# EAGLE design CAN Bus Controller with LED Lamp Drivers - REV 1 (EAGLE 9.6.2)
DOC_NAME: CAN BUS CONTROLLER; DOC_REVISION: 1; INITIALS_DRAWN: KJD
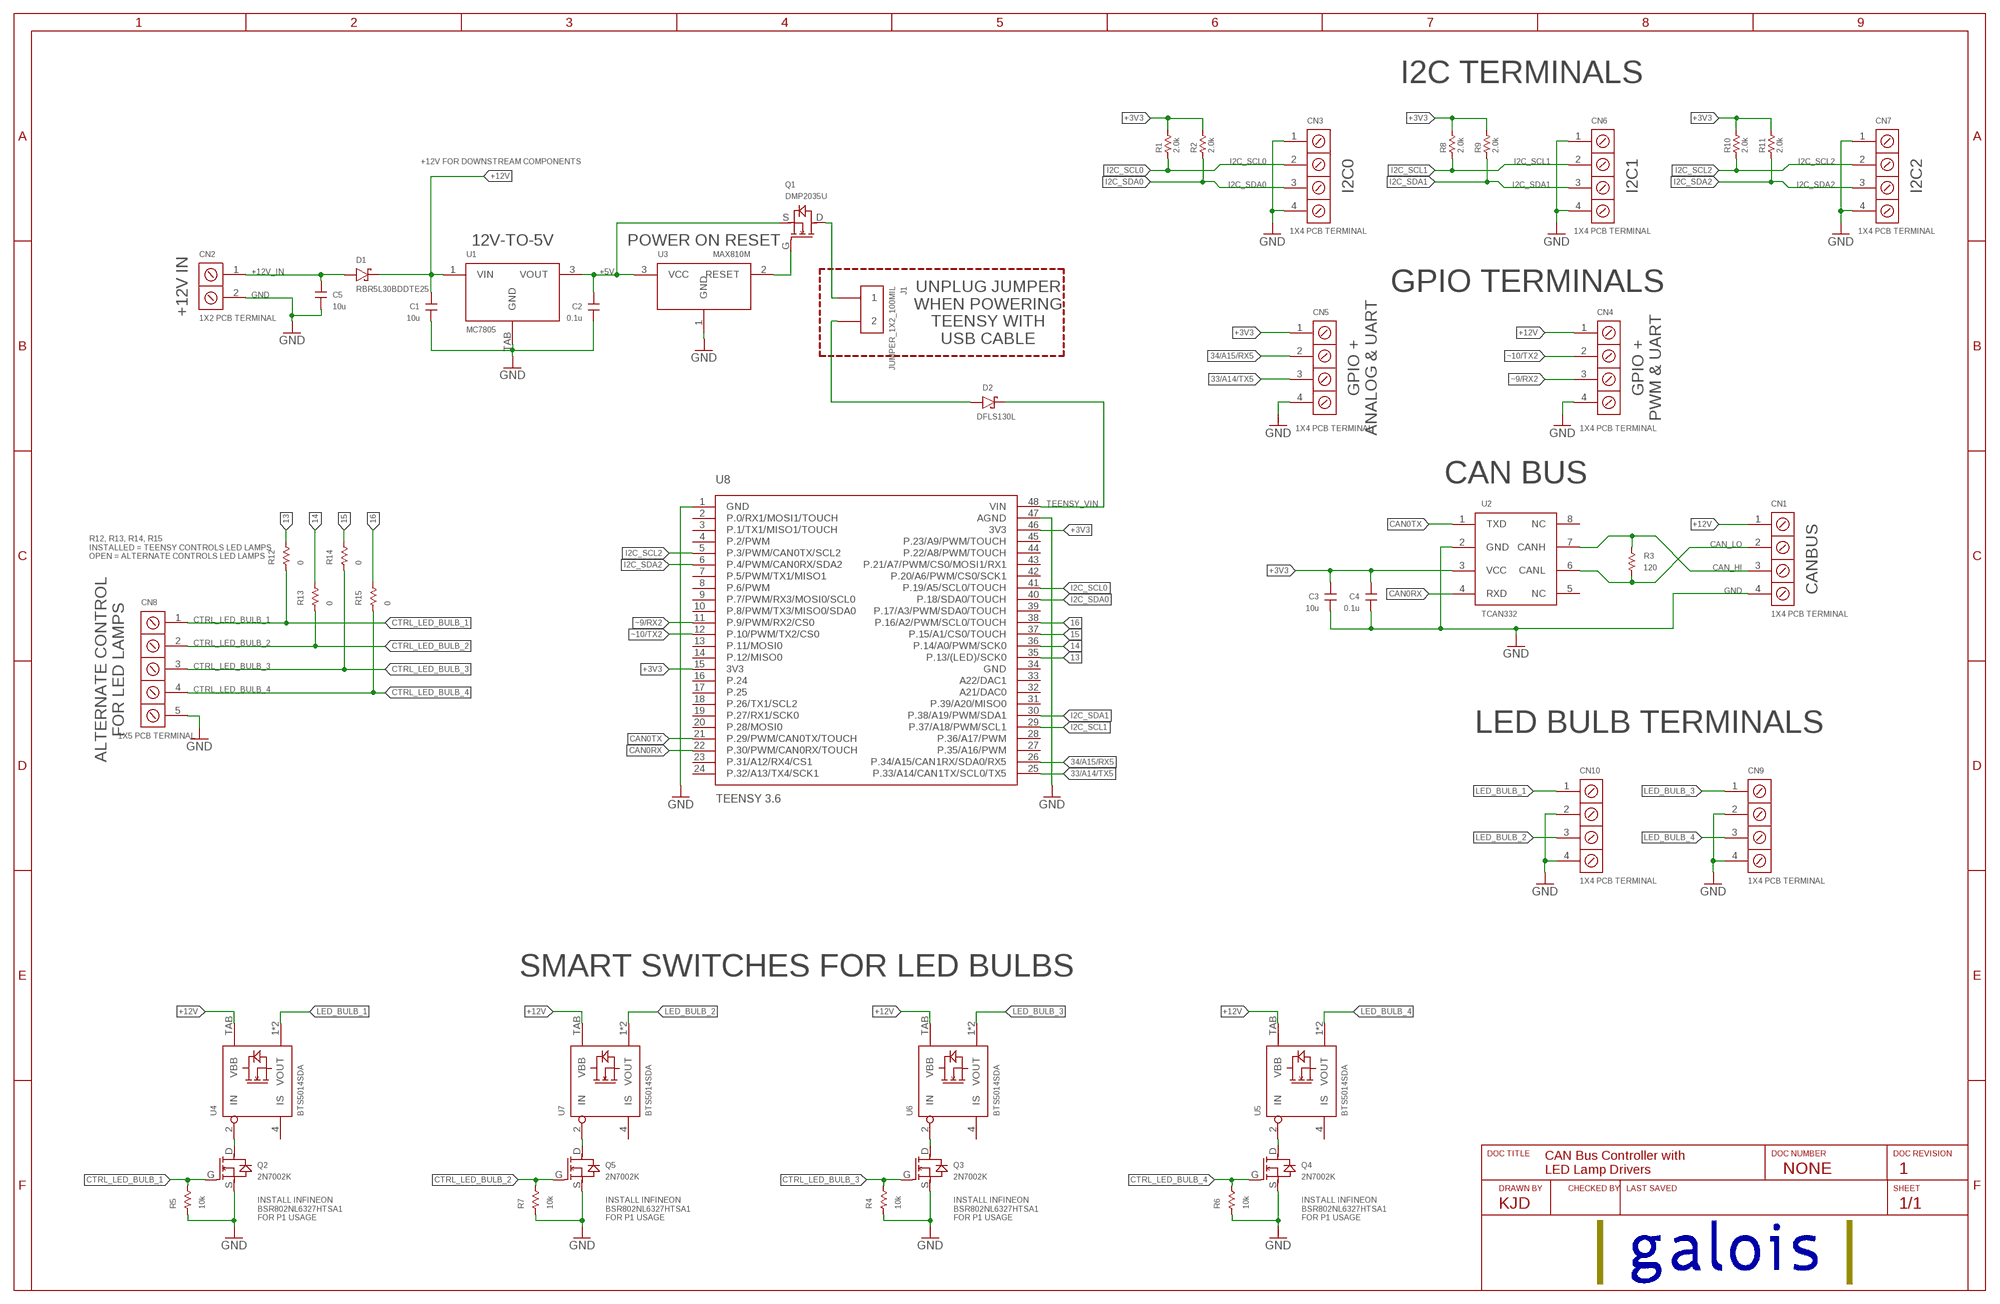
[diagram p0: schematic, sheet 1]

## Parts
C1  10u  C_SMDC1206  [EIA1206]
C2  0.1u  C_SMDC0603  [EIA0603]
C3  10u  C_SMDC1206  [EIA1206]
C4  0.1u  C_SMDC0603  [EIA0603]
C5  10u  C_SMDC1206  [EIA1206]
CN1  1X4 PCB TERMINAL  1984633  [PCB_TERM_3.5MM_PITCH_1X4]
CN2  1X2 PCB TERMINAL  1984617  [PCB_TERM_3.5MM_PITCH_1X2]
CN3  1X4 PCB TERMINAL  1984633  [PCB_TERM_3.5MM_PITCH_1X4]
CN4  1X4 PCB TERMINAL  1984633  [PCB_TERM_3.5MM_PITCH_1X4]
CN5  1X4 PCB TERMINAL  1984633  [PCB_TERM_3.5MM_PITCH_1X4]
CN6  1X4 PCB TERMINAL  1984633  [PCB_TERM_3.5MM_PITCH_1X4]
CN7  1X4 PCB TERMINAL  1984633  [PCB_TERM_3.5MM_PITCH_1X4]
CN8  1X5 PCB TERMINAL  1984646  [PCB_TERM_3.5MM_PITCH_1X5]
CN9  1X4 PCB TERMINAL  1984633  [PCB_TERM_3.5MM_PITCH_1X4]
CN10  1X4 PCB TERMINAL  1984633  [PCB_TERM_3.5MM_PITCH_1X4]
D1  RBR5L30BDDTE25  SCHOTTKYSMA  [SMA]
D2  DFLS130L  SCHOTTKYPOWERDI_123  [POWERDI_123]
J1  JUMPER_1X2_100MIL  1X2  [1X2_100MIL_THRU]
Q1  DMP2035U  [SOT-23-3]
Q2  2N7002K  [SOT-23-3]
Q3  2N7002K  [SOT-23-3]
Q4  2N7002K  [SOT-23-3]
Q5  2N7002K  [SOT-23-3]
R1  2.0k  R_SMDR0603  [EIA0603]
R2  2.0k  R_SMDR0603  [EIA0603]
R3  120  R_SMDR1210  [EIA1210]
R4  10k  R_SMDR0603  [EIA0603]
R5  10k  R_SMDR0603  [EIA0603]
R6  10k  R_SMDR0603  [EIA0603]
R7  10k  R_SMDR0603  [EIA0603]
R8  2.0k  R_SMDR0603  [EIA0603]
R9  2.0k  R_SMDR0603  [EIA0603]
R10  2.0k  R_SMDR0603  [EIA0603]
R11  2.0k  R_SMDR0603  [EIA0603]
R12  0  R_SMDR0603  [EIA0603]
R13  0  R_SMDR0603  [EIA0603]
R14  0  R_SMDR0603  [EIA0603]
R15  0  R_SMDR0603  [EIA0603]
U1  MC7805  MC78XX  [DPAK-3]
U2  TCAN332  TCAN332_CANBUS_RXTX  [SOIC-8]
U3  MAX810M  MAX809/810  [SOT23-3]
U4  BTS5014SDA  [PG-TO252-5-11]
U5  BTS5014SDA  [PG-TO252-5-11]
U6  BTS5014SDA  [PG-TO252-5-11]
U7  BTS5014SDA  [PG-TO252-5-11]
U8  TEENSY 3.6  TEENSY3.6NO_UNDER_PINS  [TEENSY3.6]

## Nets
13: R12.P$2 U8.35(P.13/(LED)/SCK0)
14: R13.P$2 U8.36(P.14/A0/PWM/SCK0)
15: R14.P$2 U8.37(P.15/A1/CS0/TOUCH)
16: R15.P$2 U8.38(P.16/A2/PWM/SCL0/TOUCH)
33/A14/TX5: CN5.3 U8.25(P.33/A14/CAN1TX/SCL0/TX5)
34/A15/RX5: CN5.2 U8.26(P.34/A15/CAN1RX/SDA0/RX5)
+3V3: C3.P$2 C4.P$2 CN5.1 R1.P$2 R2.P$2 R8.P$2 R9.P$2 R10.P$2 R11.P$2 U2.3(VCC) U8.15(3V3) U8.46(3V3)
+5V: C2.P$2 Q1.S U1.3(VOUT) U3.3(VCC)
+12V: C1.P$2 CN1.1 CN4.1 D1.C U1.1(VIN) U4.TAB(VBB) U5.TAB(VBB) U6.TAB(VBB) U7.TAB(VBB)
+12V_IN: C5.P$2 CN2.1 D1.A
CAN0RX: U2.4(RXD) U8.22(P.30/PWM/CAN0RX/TOUCH)
CAN0TX: U2.1(TXD) U8.21(P.29/PWM/CAN0TX/TOUCH)
CAN_HI: CN1.3 R3.P$2 U2.7(CANH)
CAN_LO: CN1.2 R3.P$1 U2.6(CANL)
CTRL_LED_BULB_1: CN8.1 Q2.G R5.P$2 R12.P$1
CTRL_LED_BULB_2: CN8.2 Q5.G R7.P$2 R13.P$1
CTRL_LED_BULB_3: CN8.3 Q3.G R4.P$2 R14.P$1
CTRL_LED_BULB_4: CN8.4 Q4.G R6.P$2 R15.P$1
GND: C1.P$1 C2.P$1 C3.P$1 C4.P$1 C5.P$1 CN1.4 CN2.2 CN3.1 CN3.4 CN4.4 CN5.4 CN6.1 CN6.4 CN7.1 CN7.4 CN8.5 CN9.2 CN9.4 CN10.2 CN10.4 Q2.S Q3.S Q4.S Q5.S R4.P$1 R5.P$1 R6.P$1 R7.P$1 U1.TAB(GND) U2.2(GND) U3.1(GND) U8.1(GND) U8.47(AGND)
I2C_SCL0: CN3.2 R1.P$1 U8.41(P.19/A5/SCL0/TOUCH)
I2C_SCL1: CN6.2 R8.P$1 U8.29(P.37/A18/PWM/SCL1)
I2C_SCL2: CN7.2 R10.P$1 U8.5(P.3/PWM/CAN0TX/SCL2)
I2C_SDA0: CN3.3 R2.P$1 U8.40(P.18/SDA0/TOUCH)
I2C_SDA1: CN6.3 R9.P$1 U8.30(P.38/A19/PWM/SDA1)
I2C_SDA2: CN7.3 R11.P$1 U8.6(P.4/PWM/CAN0RX/SDA2)
LED_BULB_1: CN10.1 U4.1(VOUT) U4.5(VOUT)
LED_BULB_2: CN10.3 U7.1(VOUT) U7.5(VOUT)
LED_BULB_3: CN9.1 U6.1(VOUT) U6.5(VOUT)
LED_BULB_4: CN9.3 U5.1(VOUT) U5.5(VOUT)
N$1: J1.1 Q1.D
N$2: D2.A J1.2
N$3: Q2.D U4.2(IN)
N$4: Q4.D U5.2(IN)
N$5: Q5.D U7.2(IN)
N$20: Q3.D U6.2(IN)
N$26: Q1.G U3.2(RESET)
TEENSY_VIN: D2.C U8.48(VIN)
~9/RX2: CN4.3 U8.11(P.9/PWM/RX2/CS0)
~10/TX2: CN4.2 U8.12(P.10/PWM/TX2/CS0)
Unconnected: U2.5(NC) U2.8(NC) U4.4(IS) U5.4(IS) U6.4(IS) U7.4(IS) U8.2(P.0/RX1/MOSI1/TOUCH) U8.3(P.1/TX1/MISO1/TOUCH) U8.4(P.2/PWM) U8.7(P.5/PWM/TX1/MISO1) U8.8(P.6/PWM) U8.9(P.7/PWM/RX3/MOSI0/SCL0) U8.10(P.8/PWM/TX3/MISO0/SDA0) U8.13(P.11/MOSI0) U8.14(P.12/MISO0) U8.16(P.24) U8.17(P.25) U8.18(P.26/TX1/SCL2) U8.19(P.27/RX1/SCK0) U8.20(P.28/MOSI0) U8.23(P.31/A12/RX4/CS1) U8.24(P.32/A13/TX4/SCK1) U8.27(P.35/A16/PWM) U8.28(P.36/A17/PWM) U8.31(P.39/A20/MISO0) U8.32(A21/DAC0) U8.33(A22/DAC1) U8.34(GND) U8.39(P.17/A3/PWM/SDA0/TOUCH) U8.42(P.20/A6/PWM/CS0/SCK1) U8.43(P.21/A7/PWM/CS0/MOSI1/RX1) U8.44(P.22/A8/PWM/TOUCH) U8.45(P.23/A9/PWM/TOUCH)

## Notes on the sheet
- I2C TERMINALS
- +12V FOR DOWNSTREAM COMPONENTS
- I2C0 | I2C1 | I2C2
- 12V-TO-5V | POWER ON RESET
- +12V IN
- GPIO TERMINALS
- UNPLUG JUMPER
  WHEN POWERING
  TEENSY WITH
  USB CABLE
- GPIO +
  ANALOG & UART
- GPIO +
  PWM & UART
- CAN BUS
- R12, R13, R14, R15
  INSTALLED = TEENSY CONTROLS LED LAMPS
  OPEN = ALTERNATE CONTROLS LED LAMPS
- CANBUS
- ALTERNATE CONTROL
  FOR LED LAMPS
- LED BULB TERMINALS
- SMART SWITCHES FOR LED BULBS
- CAN Bus Controller with
  LED Lamp Drivers
- NONE | 1
- KJD
- INSTALL INFINEON
  BSR802NL6327HTSA1
  FOR P1 USAGE
- INSTALL INFINEON
  BSR802NL6327HTSA1
  FOR P1 USAGE
- INSTALL INFINEON
  BSR802NL6327HTSA1
  FOR P1 USAGE
- INSTALL INFINEON
  BSR802NL6327HTSA1
  FOR P1 USAGE

## Library data of the parts
C1 C3 C5 = USER_SMT_CHIP_STANDARD:C_SMD; MPN: CL31A106KBHNNNE; PACKAGE: 1206
C2 C4 = USER_SMT_CHIP_STANDARD:C_SMD; MPN: CL10B104KA8NNNC; PACKAGE: 0603
CN1 CN3-CN7 CN9 CN10 = USER_PCB_TERMINALS:1984633; MPN: 1984633
CN2 = USER_PCB_TERMINALS:1984617; MPN: 1984617
CN8 = USER_PCB_TERMINALS:1984646; MPN: 1984646
D1 = USER_DIODES:SCHOTTKY; MPN: RBR5L30BDDTE25
D2 = USER_DIODES:SCHOTTKY; MPN: DFLS130L-7
J1 = USER_CON_PINS:1X2; MPN: QPC02SXGN-RC
Q1 = USER_MOSFETS:DMP2035U; MPN: DMP2035U-7
Q2-Q5 = USER_MOSFETS:2N7002K; MPN: 2N7002K-7
R1 R2 R8-R11 = USER_SMT_CHIP_STANDARD:R_SMD; MPN: ERJ-3EKF2001V
R3 = USER_SMT_CHIP_STANDARD:R_SMD; MPN: AC1210FR-07120RL
R4-R7 = USER_SMT_CHIP_STANDARD:R_SMD; MPN: ERJ-3EKF1002V
R12-R15 = USER_SMT_CHIP_STANDARD:R_SMD; MPN: ERJ-3GEY0R00V
U1 = USER_PMIC:MC78XX; MPN: MC7805CDTRKG
U2 = USER_SERIAL_TRANSCEIVERS:TCAN332_CANBUS_RXTX; MPN: TCAN332DR
U3 = USER_PMIC:MAX809/810; MPN: MAX810MTRG
U4-U7 = USER_SMART_SWITCHES:BTS5014SDA; MPN: BTS5014SDAAUMA1
U8 = USER_PJRC_TEENSY:TEENSY3.6

## Board
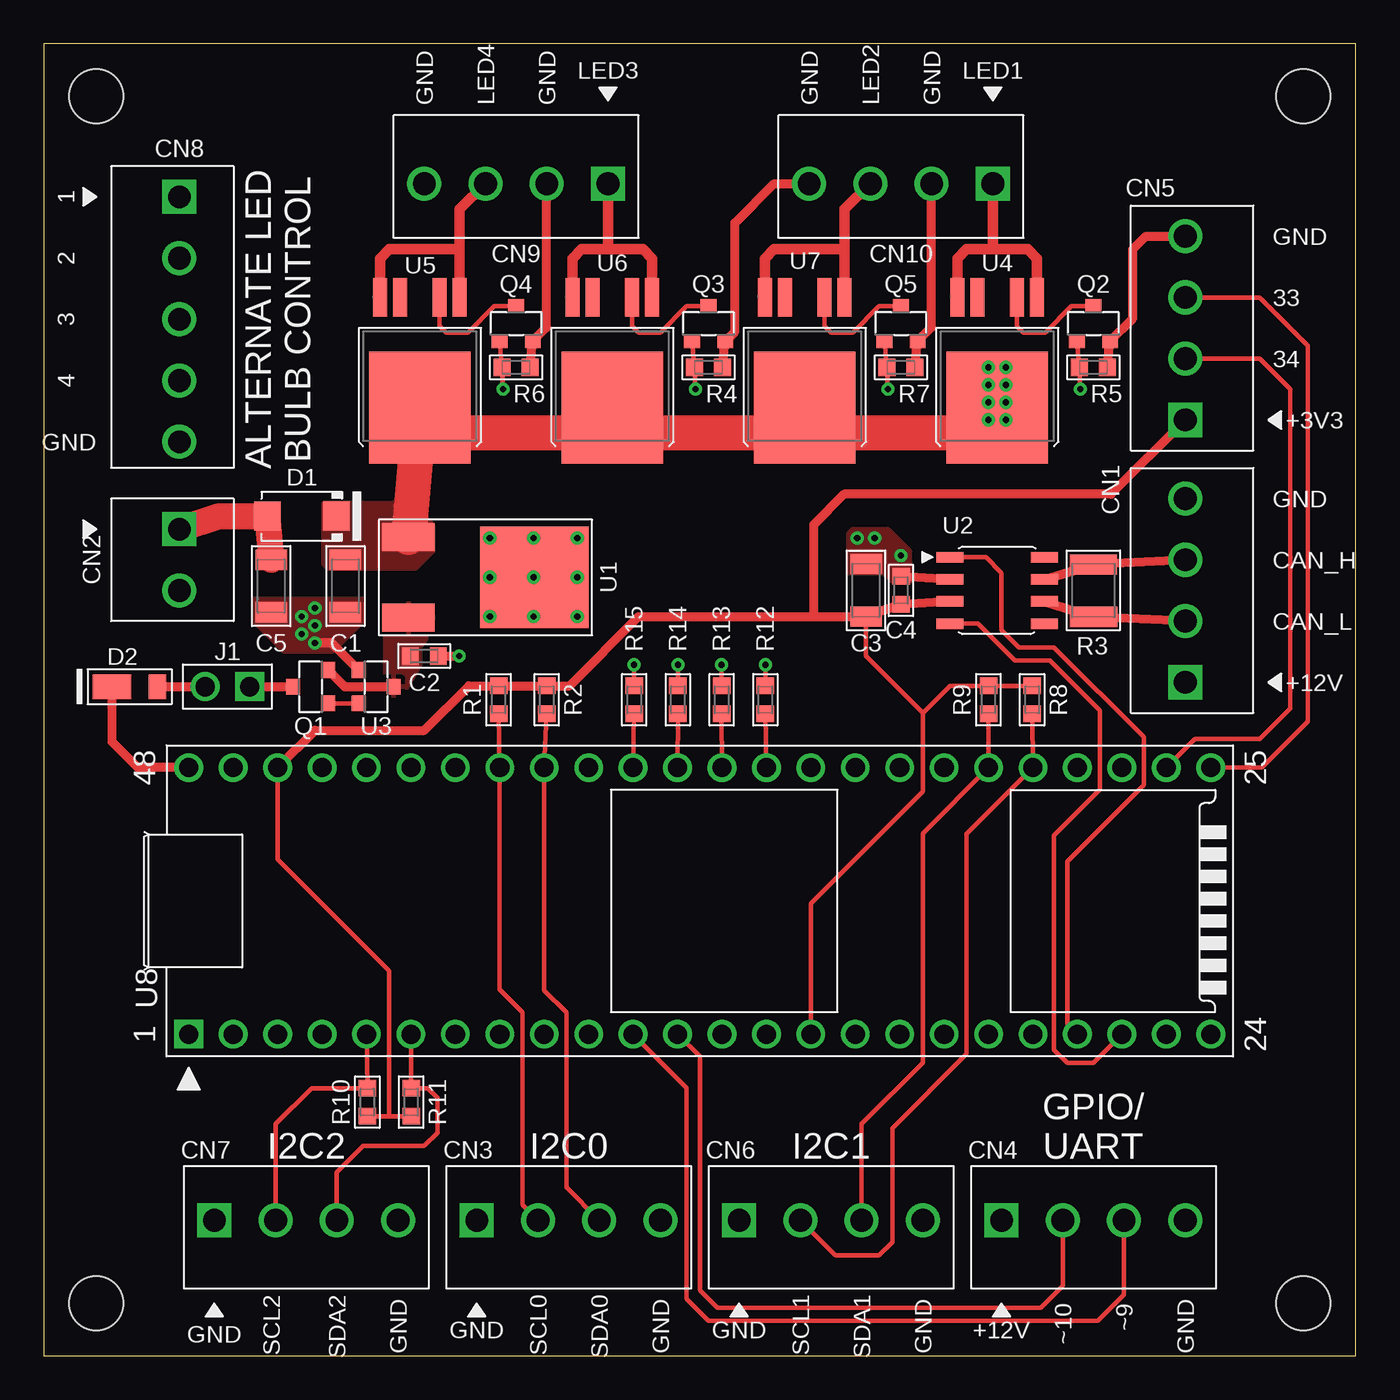
[diagram p1: board, top side]
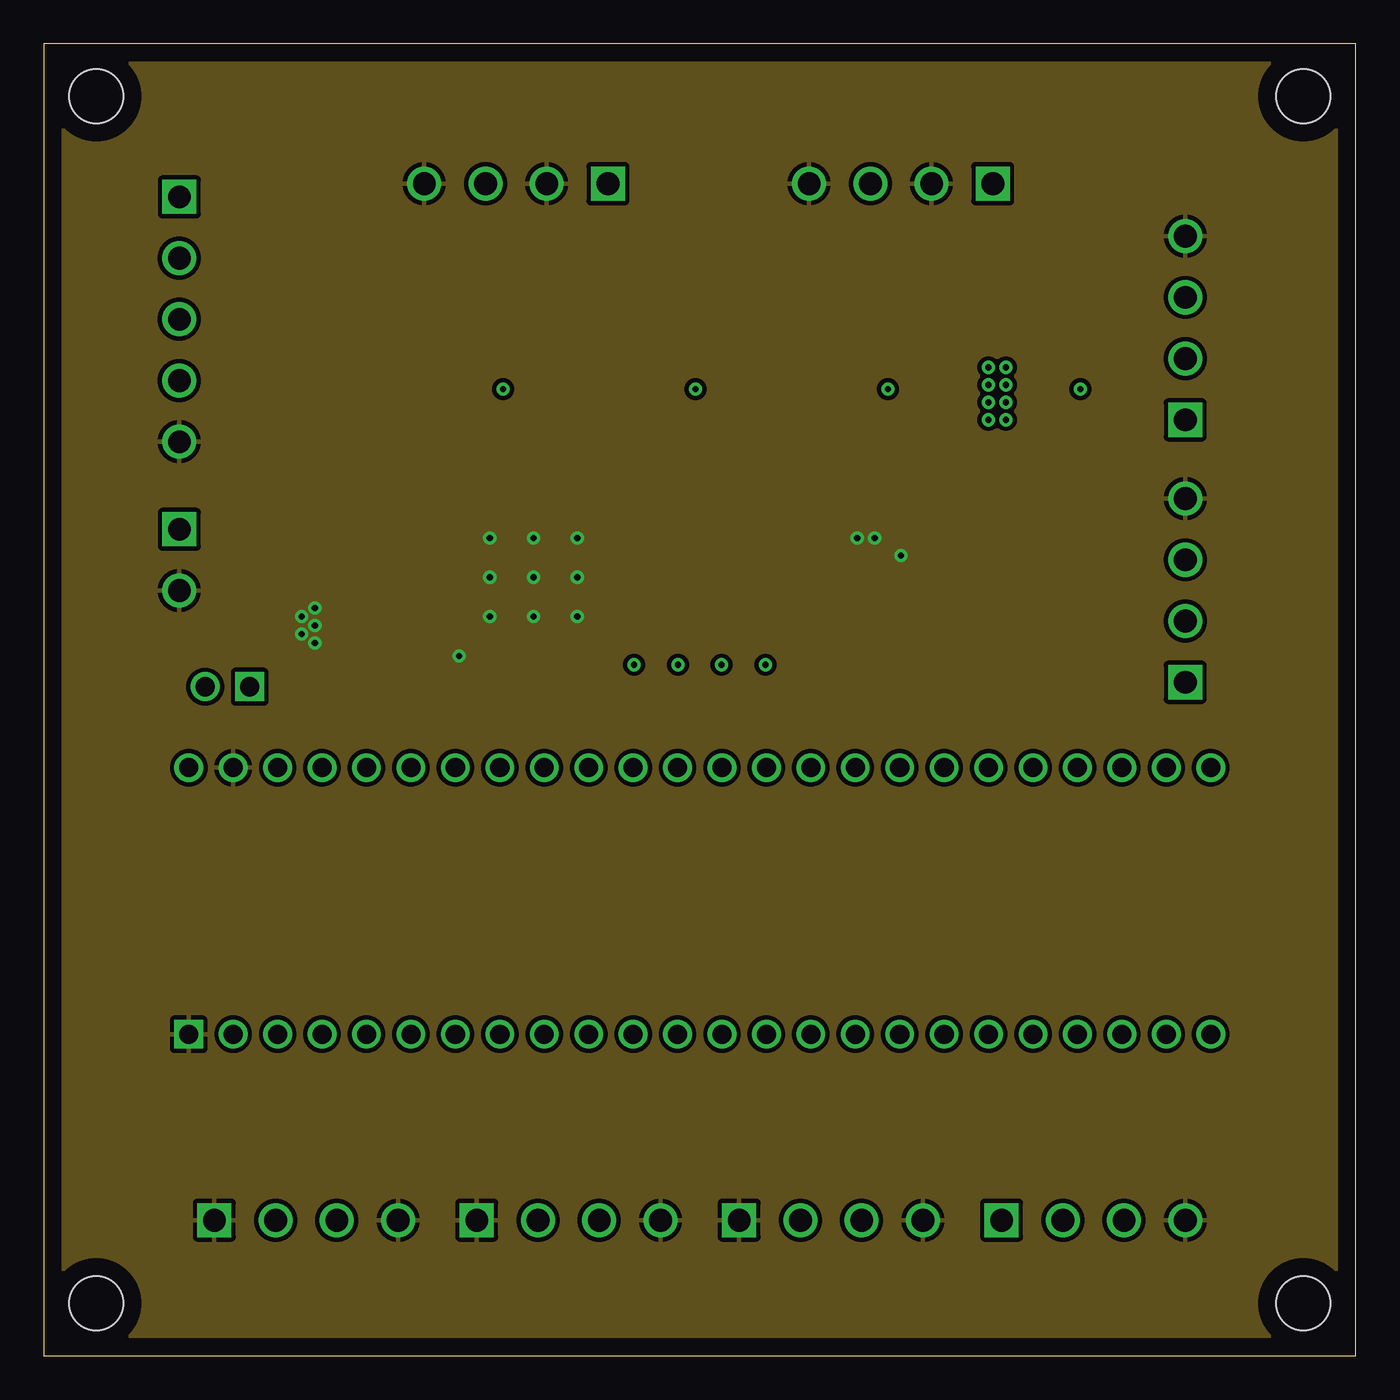
[diagram p2: board, inner layer Route2]
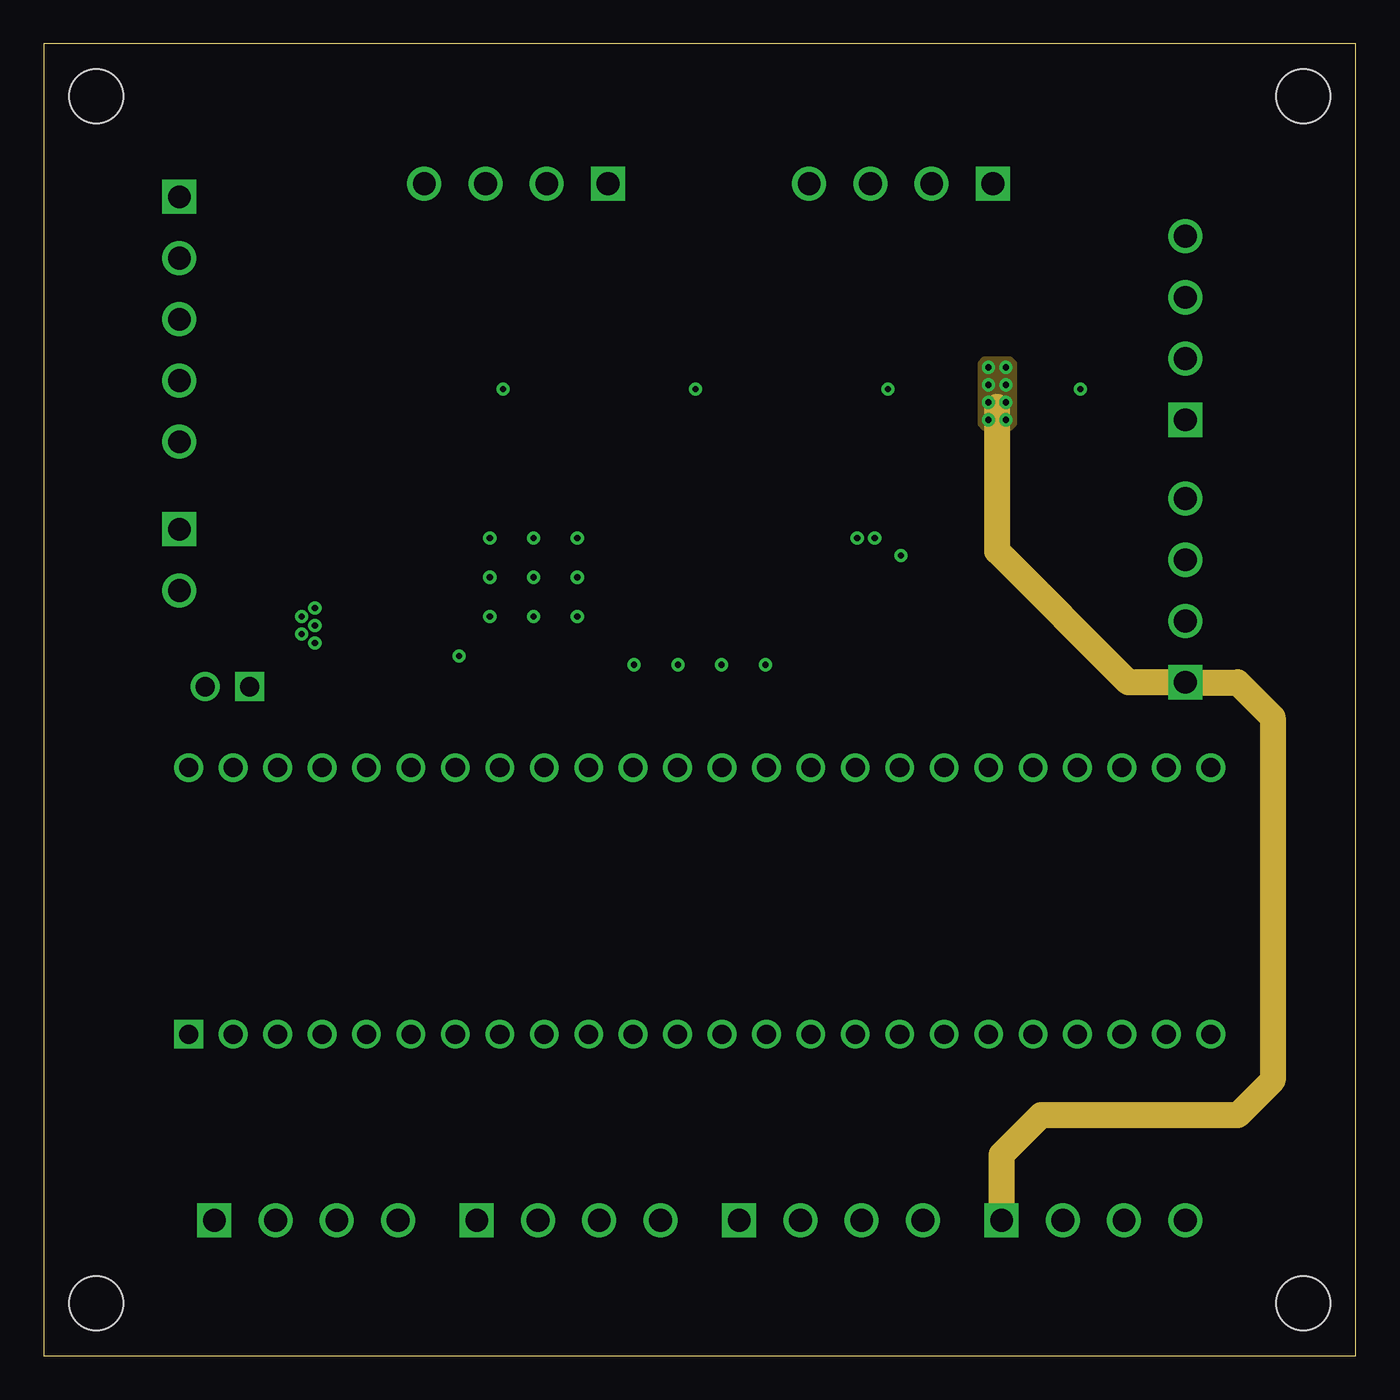
[diagram p3: board, inner layer Route15]
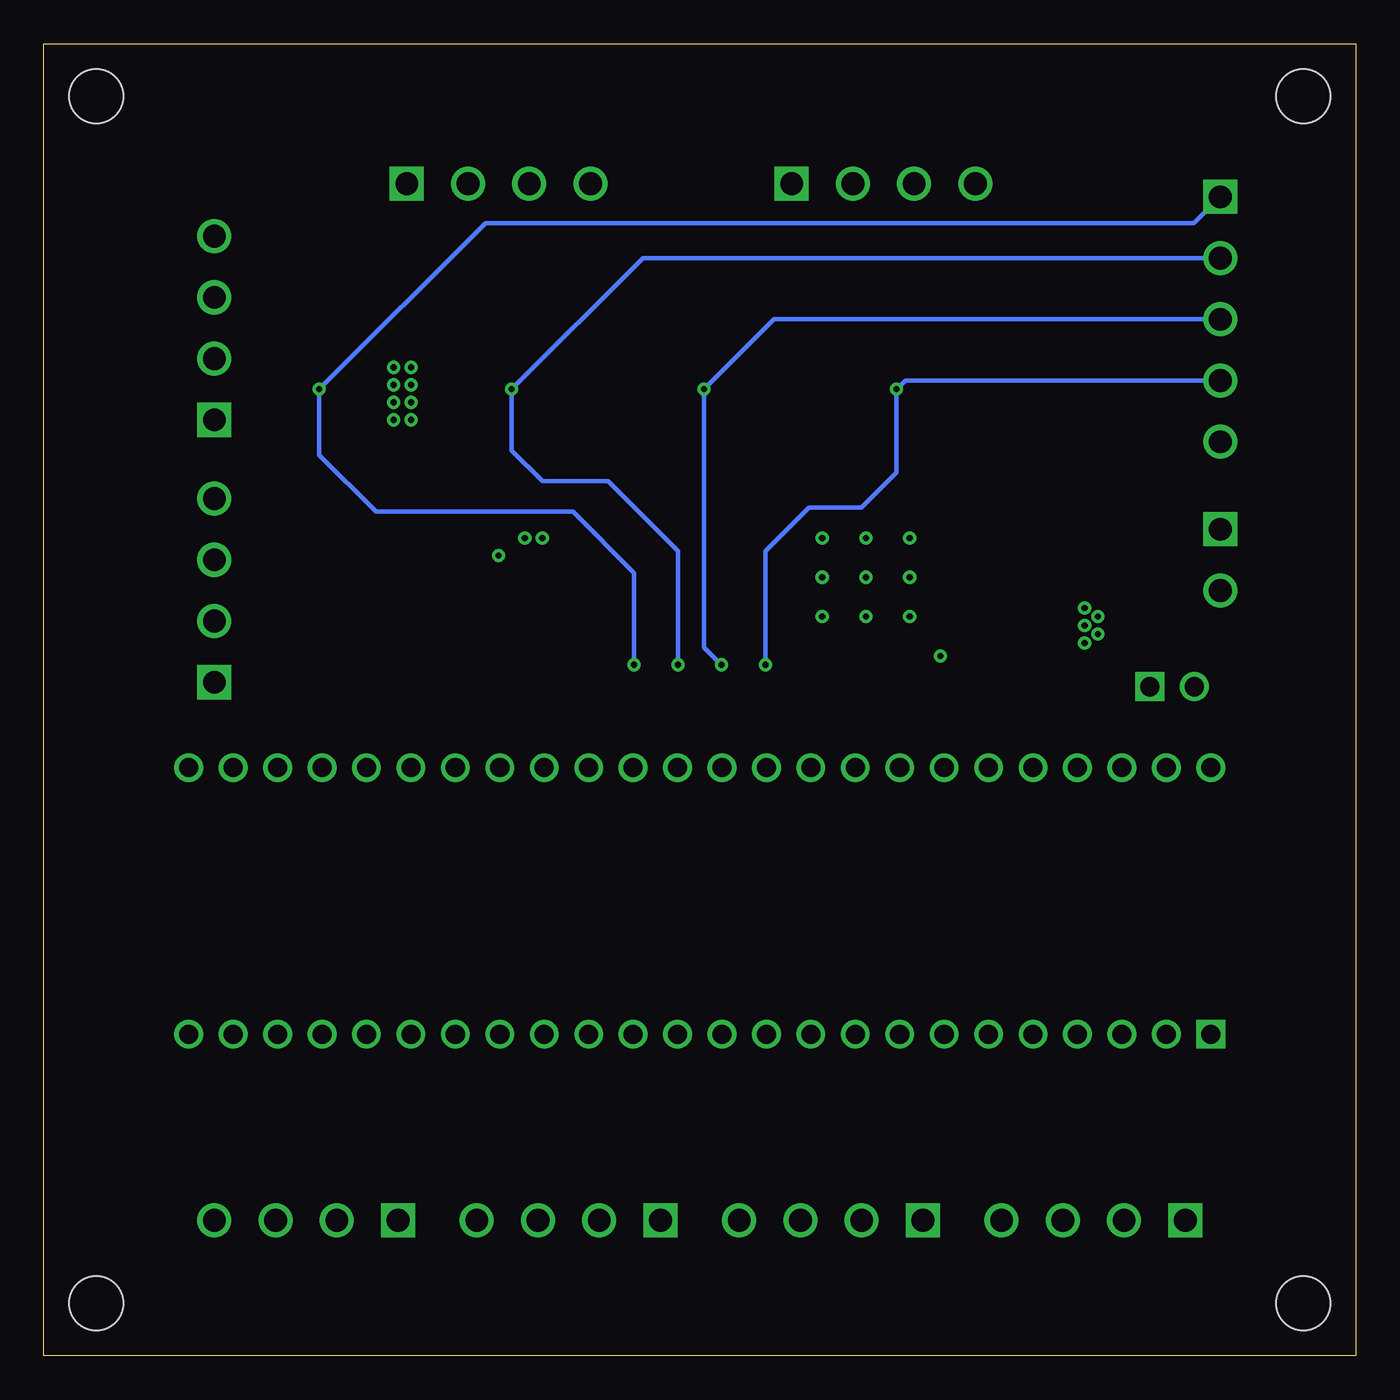
[diagram p4: board, bottom side, seen from below]

Size 75 x 75 mm. Coordinates in mm from the lower left corner, seen from the top.
Outline: 0,0 75,0 75,75 0,75 0,0
Copper layers (1+2*15+16): Top 0.035mm / dielectric 1.5mm / Route2 0.035mm / dielectric 0.15mm / Route15 0.035mm / dielectric 0.2mm / Bottom 0.035mm
Design rules "default *": minimum track width 6mil, minimum drill 0.35mm, track to track 6mil, track to pad 6mil, pad to pad 6mil, via to via 6mil, smd to smd 6mil, copper to edge 40mil, drill to drill 6mil, minimum pad ring 10mil, minimum via ring 8mil, stop-mask expansion 4mil, vias tented up to drill 0mil, thermal gap 10mil
Holes 3.1 mm at 3,3 72,3 72,72 3,72

### Footprints (pad centres in the part's own frame; a part is rotated, then mirrored left to right if it is on the bottom)
EIA1206 = smd 1.15 x 1.8: P$1 -1.5,0; P$2 1.5,0
EIA0603 = smd 0.95 x 1: P$1 -0.8,0; P$2 0.8,0
PCB_TERM_3.5MM_PITCH_1X4 = drill 1.3 square: 1 -5.25,0 | drill 1.3: 2 -1.75,0; 3 1.75,0; 4 5.25,0
PCB_TERM_3.5MM_PITCH_1X2 = drill 1.3 square: 1 -1.75,0 | drill 1.3: 2 1.75,0
PCB_TERM_3.5MM_PITCH_1X5 = drill 1.3 square: 1 -7,0 | drill 1.3: 2 -3.5,0; 3 0,0; 4 3.5,0; 5 7,0
SMA = smd 1.52 x 1.68: A -1.97,0; C 1.97,0
POWERDI_123 = smd 1 x 1.4: A 1,0 | smd 2.2 x 1.4: C -1.6,0
1X2_100MIL_THRU = drill 1.1 square: 1 0,1.27 | drill 1.1: 2 0,-1.27
SOT-23-3 = smd 0.9 x 0.8: D 0,1; G -0.95,-1; S 0.95,-1
EIA1210 = smd 1.15 x 2.7: P$1 -1.508,-0.01; P$2 1.484,0.004
DPAK-3 = smd 3 x 1.6: 1 4.4,-2.3; 3 4.4,2.3 | smd 6.2 x 5.8: TAB -2.8,0
SOIC-8 = smd 1.55 x 0.6: 1 -2.7,1.905; 2 -2.7,0.635; 3 -2.7,-0.635; 4 -2.7,-1.905; 5 2.7,-1.905; 6 2.7,-0.635; 7 2.7,0.635; 8 2.7,1.905
SOT23-3 = smd 0.9 x 0.8: 1 -0.95,-1; 2 0.95,-1; 3 0,1
PG-TO252-5-11 = smd 0.8 x 2.2: 1 -2.28,0; 2 -1.14,0; 4 1.14,0; 5 2.28,0 | smd 5.8 x 6.4: TAB 0,6.3
TEENSY3.6 = drill 1.092 square: 1 -7.62,29.21 | drill 1.092: 2 -7.62,26.67; 3 -7.62,24.13; 4 -7.62,21.59; 5 -7.62,19.05; 6 -7.62,16.51; 7 -7.62,13.97; 8 -7.62,11.43; 9 -7.62,8.89; 10 -7.62,6.35; 11 -7.62,3.81; 12 -7.62,1.27; 13 -7.62,-1.27; 14 -7.62,-3.81; 15 -7.62,-6.35; 16 -7.62,-8.89; 17 -7.62,-11.43; 18 -7.62,-13.97; 19 -7.62,-16.51; 20 -7.62,-19.05; 21 -7.62,-21.59; 22 -7.62,-24.13; 23 -7.62,-26.67; 24 -7.62,-29.21; 25 7.62,-29.21; 26 7.62,-26.67; 27 7.62,-24.13; 28 7.62,-21.59; 29 7.62,-19.05; 30 7.62,-16.51; 31 7.62,-13.97; 32 7.62,-11.43; 33 7.62,-8.89; 34 7.62,-6.35; 35 7.62,-3.81; 36 7.62,-1.27; 37 7.62,1.27; 38 7.62,3.81; 39 7.62,6.35; 40 7.62,8.89; 41 7.62,11.43; 42 7.62,13.97; 43 7.62,16.51; 44 7.62,19.05; 45 7.62,21.59; 46 7.62,24.13; 47 7.62,26.67; 48 7.62,29.21

### Placement (x,y rotation side)
C1  17.25,44 90 top
C2  21.75,40 180 top
C3  47,43.75 270 top
C4  49,43.75 270 top
C5  13,44 90 top
CN1  65.25,43.75 90 top
CN2  7.75,45.5 270 top
CN3  30,7.75 0 top
CN4  60,7.75 0 top
CN5  65.25,58.75 90 top
CN6  45,7.75 0 top
CN7  15,7.75 0 top
CN8  7.75,59.25 270 top
CN9  27,67 180 top
CN10  49,67 180 top
D1  14.75,48 0 top
D2  5.5,38.25 0 top
J1  10.5,38.25 270 top
Q1  15.25,38.25 90 top
Q2  60,59 0 top
Q3  38,59 0 top
Q4  27,59 0 top
Q5  49,59 0 top
R1  26,37.5 90 top
R2  28.75,37.5 90 top
R3  60,43.75 90 top
R4  38,56.5 180 top
R5  60,56.5 180 top
R6  27,56.5 180 top
R7  49,56.5 180 top
R8  56.5,37.5 90 top
R9  54,37.5 90 top
R10  18.5,14.5 270 top
R11  21,14.5 270 top
R12  41.25,37.5 270 top
R13  38.75,37.5 270 top
R14  36.25,37.5 270 top
R15  33.75,37.5 270 top
U1  25.25,44.5 180 top
U2  54.5,43.75 0 top
U3  19,38.25 270 top
U4  54.5,60.5 180 top
U5  21.5,60.5 180 top
U6  32.5,60.5 180 top
U7  43.5,60.5 180 top
U8  37.5,26 90 top

### Tracks (layer width: path | path; a pad name or v marks a point on that pad's centre or on a via)
13
  Top 0.25: U8.35 R12.P$2
14
  Top 0.25: U8.36 R13.P$2
15
  Top 0.25: U8.37 R14.P$2
16
  Top 0.25: U8.38 R15.P$2
33/A14/TX5
  Top 0.25: U8.25 69.62,33.62 72.25,36.25 72.25,57.75 69.5,60.5 CN5.3
34/A15/RX5
  Top 0.25: U8.26 65.8,35.25 69.5,35.25 71.25,37 71.25,55.25 69.5,57 CN5.2
+3V3
  Top 0.25: R10.P$2 19.75,13.7 | 19.75,13.7 R11.P$2 | U8.46 13.37,28.38 19.75,22 19.75,13.7 | U8.15 43.85,25.85 50.25,32.25 50.25,36.75 | R8.P$2 R9.P$2 51.8,38.3 50.25,36.75 | 50.25,36.75 47,40 C3.P$2
  Top 0.5: U2.3 C4.P$2 C3.P$2 44,42.25 | U8.46 15.5,35.75 21.75,35.75 24.3,38.3 R1.P$2 R2.P$2 30.05,38.3 34,42.25 44,42.25 | CN5.1 61,49.25 45.75,49.25 44,47.5 44,42.25
+5V
  Top 0.5: Q1.S 17.2,38.25 U3.3
  pour Top: 19.5,43 19.5,37.75 20.5,37.75 21.5,39.5 21.5,40.5 22.25,41.5 22.25,43
+12V  (via drill 0.35)
  Top 0.25: U4.TAB v54,54.5
  Top 2: 21.37,52.74 U5.TAB 21.5,52.25 | 21.37,52.74 U1.1 | 54.5,52.25 U4.TAB | 54.5,55 U4.TAB | U6.TAB 32.5,52.74 | 32.5,52.74 21.37,52.74 | U7.TAB 43.5,52.74 | 43.5,52.74 32.5,52.74 | U4.TAB 54.5,52.74 43.5,52.74
  Route15 1.5: 54.5,54.25 54.5,46 62,38.5 CN1.1 68.25,38.5 70.25,36.5 70.25,15.75 68.25,13.75 57,13.75 54.75,11.5 CN4.1
  other vias: 54,56.5 55,56.5 54,55.5 55,55.5 55,54.5 54,53.5 55,53.5
  pour Top (no thermals): 16,48.75 16,45.25 16.25,45 21.25,45 22.25,46 22.25,47.5 21,48.75
  pour Route15: 53.5,56.75 53.5,53.25 53.75,53 55.25,53 55.5,53.25 55.5,56.75 55.25,57 53.75,57
+12V_IN
  Top 1.5: CN2.1 10,48 D1.A C5.P$2
CAN0RX
  Top 0.25: U8.22 60,16.75 58.5,16.75 57.75,17.5 57.75,29.75 60.38,32.38 60.38,36.88 57.5,39.75 55.5,39.75 53.41,41.84 U2.4
CAN0TX
  Top 0.25: U8.21 58.5,18.97 58.5,28.25 62.88,32.62 62.88,35.38 57.75,40.5 55.75,40.5 54.75,41.5 54.75,44.75 53.84,45.66 U2.1
CAN_HI
  Top 0.5: U2.7 R3.P$2 CN1.3
CAN_LO
  Top 0.5: U2.6 R3.P$1 CN1.2
CTRL_LED_BULB_1  (via drill 0.35)
  Top 0.25: v59.25,55.25 R5.P$2 Q2.G | R12.P$1 v41.25,39.5
  Bottom 0.25: CN8.1 9.25,64.75 49.75,64.75 v59.25,55.25 59.25,51.5 56,48.25 44.75,48.25 41.25,44.75 v41.25,39.5
CTRL_LED_BULB_2  (via drill 0.35)
  Top 0.25: v48.25,55.25 R7.P$2 Q5.G | R13.P$1 v38.75,39.5
  Bottom 0.25: CN8.2 40.75,62.75 v48.25,55.25 48.25,51.75 46.5,50 42.75,50 38.75,46 v38.75,39.5
CTRL_LED_BULB_3  (via drill 0.35)
  Top 0.25: v37.25,55.25 R4.P$2 Q3.G | R14.P$1 v36.25,39.5
  Bottom 0.25: CN8.3 33.25,59.25 v37.25,55.25 37.25,40.5 v36.25,39.5
CTRL_LED_BULB_4  (via drill 0.35)
  Top 0.25: v26.25,55.25 R6.P$2 Q4.G | R15.P$1 v33.75,39.5
  Bottom 0.25: v33.75,39.5 33.75,46 31.25,48.5 28.25,48.5 26.25,50.5 v26.25,55.25 25.75,55.75 CN8.4
GND  (via drill 0.35)
  Top 0.5: C2.P$1 v23.75,40 | U3.1 16.45,40.75 v15.5,40.75 | U2.2 C4.P$1 | R6.P$1 Q4.S 28.75,58.8 CN9.2 | R4.P$1 Q3.S 39.5,58.55 39.5,64.75 41.75,67 CN10.4 | R7.P$1 Q5.S 50.75,58.8 CN10.2 | R5.P$1 Q2.S 62.25,59.3 62.25,63.25 63,64 CN5.4 | U1.TAB v28,44.5
  other vias: 14.75,42.25 15.5,42.75 15.5,41.75 14.75,41.25 46.5,46.75 47.5,46.75 49,45.75 25.5,42.25 30.5,42.25 30.5,46.75 25.5,46.75 25.5,44.5 30.5,44.5 28,42.25 28,46.75
  pour Top: 12,43.25 12,42 13.75,40.25 16.5,40.25 18.25,42 18.25,43.25
  pour Top: 46,47 46,44.75 48,44.75 48.5,44.25 49.5,44.25 49.5,46 48.25,47.25 46.25,47.25
  pour Route2 (isolate 0.25): 0,75 0,0 75,0 75,75
I2C_SCL0
  Top 0.25: R1.P$1 U8.41 26.07,20.93 27.38,19.62 27.38,8.62 CN3.2
I2C_SCL1
  Top 0.25: R8.P$1 U8.29 52.75,29.82 52.75,17.25 48.5,13 48.5,6.5 47.75,5.75 45.25,5.75 CN6.2
I2C_SCL2
  Top 0.25: U8.5 R10.P$1 15.3,15.3 13.25,13.25 CN7.2
I2C_SDA0
  Top 0.25: R2.P$1 U8.40 28.61,20.89 29.88,19.62 29.88,9.62 CN3.3
I2C_SDA1
  Top 0.25: R9.P$1 U8.30 50.25,29.86 50.25,16.75 46.75,13.25 CN6.3
I2C_SDA2
  Top 0.25: U8.6 R11.P$1 21.95,15.3 22.5,14.75 22.5,12.75 21.75,12 18.25,12 16.75,10.5 CN7.3
LED_BULB_1
  Top 0.6: U4.5 52.22,62.72 52.75,63.25 54.25,63.25 | U4.1 56.78,62.72 56.25,63.25 54.25,63.25 | CN10.1 54.25,63.25
LED_BULB_2
  Top 0.6: U7.1 45.78,63.25 | 45.78,63.25 45.78,65.53 CN10.3 | U7.5 41.22,62.72 41.75,63.25 45.78,63.25
LED_BULB_3
  Top 0.6: U6.5 30.22,62.72 30.75,63.25 32.25,63.25 | U6.1 34.78,62.72 34.25,63.25 32.25,63.25 | CN9.1 32.25,63.25
LED_BULB_4
  Top 0.6: 23.78,63.25 23.78,65.53 CN9.3 | 23.78,63.25 U5.1 | U5.5 19.22,62.72 19.75,63.25 23.78,63.25
N$1
  Top 0.5: J1.1 Q1.D
N$2
  Top 0.5: D2.A J1.2
N$3
  Top 0.25: U4.2 55.64,58.86 56,58.5 57.25,58.5 58.75,60 Q2.D
N$4
  Top 0.25: U5.2 22.64,58.86 23,58.5 24.25,58.5 25.75,60 Q4.D
N$5
  Top 0.25: U7.2 44.64,58.86 45,58.5 46.25,58.5 47.75,60 Q5.D
N$20
  Top 0.25: U6.2 33.64,58.86 34,58.5 35.25,58.5 36.75,60 Q3.D
N$26
  Top 0.25: Q1.G U3.2
TEENSY_VIN
  Top 0.5: U8.48 5.38,33.62 3.9,35.1 D2.C
~9/RX2
  Top 0.25: U8.11 36.75,15.32 36.75,3.25 38,2 60.25,2 61.75,3.5 CN4.3
~10/TX2
  Top 0.25: U8.12 37.5,17.11 37.5,3.75 38.5,2.75 57,2.75 58.25,4 CN4.2

### Text on the board
tPlace: LED3 | LED1 | GND | LED4 | GND | GND | LED2 | GND | 1 | GND | 2 | 33 | 3 | ALTERNATE LED / BULB CONTROL | 34 | 4 | +3V3 | GND | GND | CAN_H | CAN_L | +12V | I2C2 | I2C0 | I2C1 | GPIO/ / UART | SCL2 | SDA2 | SCL0 | SDA0 | SCL1 | SDA1 | GND | GND | GND | ~10 | ~9 | GND | GND | GND | GND | +12V